# EAGLE schematic Pi2AVR (EAGLE 7.6.0)
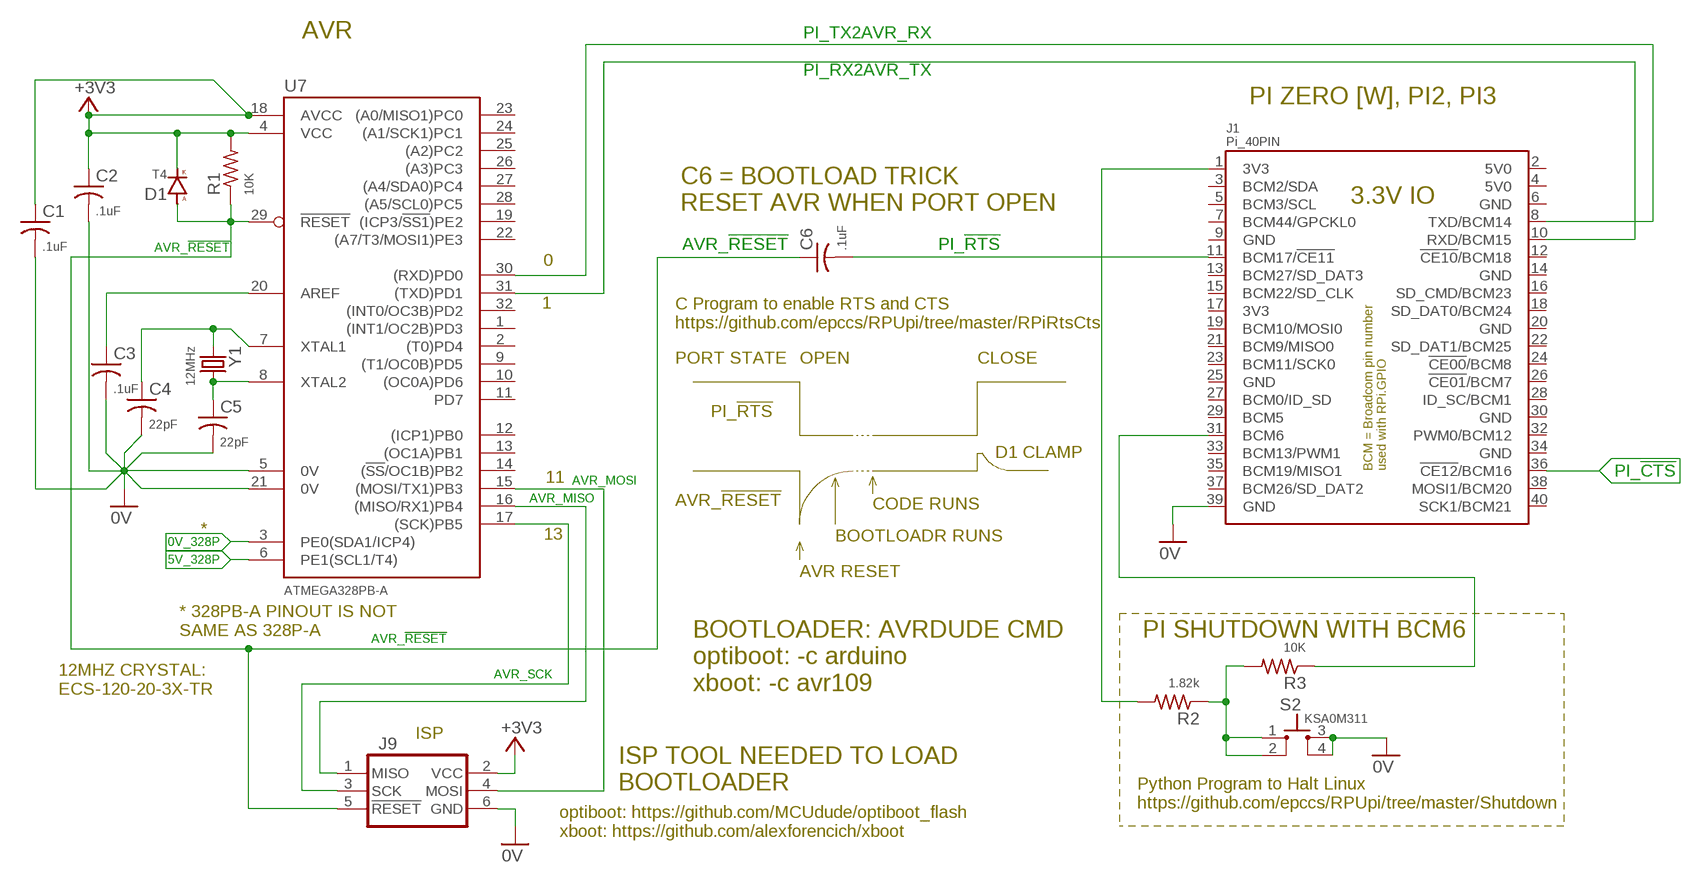
[diagram p0: schematic, sheet 1]

## Parts
C1  .1uF  CC0603A  [C0603(1608)]
C2  .1uF  CC0603A  [C0603(1608)]
C3  .1uF  CC0603A  [C0603(1608)]
C4  22pF  CC0603A  [C0603(1608)]
C5  22pF  CC0603A  [C0603(1608)]
C6  .1uF  CC0603A  [C0603(1608)]
D1  T4  DSOD123  [SOD123]
J1  Pi_40PIN  RPI-ZERO90  [RASPI_ZERO_V40PIN]
J9  ISP-SPIPTH  [ISP]
R1  10K  R0805  [C0805(2012)]
R2  1.82k  R0805  [C0805(2012)]
R3  10K  R0805  [C0805(2012)]
S2  KSA0M311  [0M311]
U7  ATMEGA328PB-A  ATMEGA328PB-AU  [TQFP32-08]
Y1  12MHz  CSM-3X  [CSM-3X]

## Nets
0V: C1.2 C2.2 C3.2 C4.2 C5.2 J1.39(GND) J9.6(GND) S2.3 S2.4 U7.5(0V) U7.21(0V)
0V_328P: U7.3(PE0(SDA1/ICP4))
3V3@1: J1.1(3V3) R2.2
5V_328P: U7.6(PE1(SCL1/T4))
+3V3: C1.1 C2.1 D1.C(K) J9.2(VCC) R1.2 U7.4(VCC) U7.18(AVCC)
AVR_!RESET: C6.1 D1.A J9.5(!RESET) R1.1 U7.29(!RESET)
AVR_MISO: J9.1(MISO) U7.16((MISO/RX1)PB4)
AVR_MOSI: J9.4(MOSI) U7.15((MOSI/TX1)PB3)
AVR_SCK: J9.3(SCK) U7.17((SCK)PB5)
MGR_AREF: C3.1 U7.20(AREF)
N$1: J1.31(BCM6) R3.1
N$7: R2.1 R3.2 S2.1 S2.2
PI_!CTS!: J1.36(!CE12!/BCM16)
PI_!RTS!: C6.2 J1.11(BCM17/!CE11!)
PI_RX2AVR_TX: J1.10(RXD/BCM15) U7.31((TXD)PD1)
PI_TX2AVR_RX: J1.8(TXD/BCM14) U7.30((RXD)PD0)
XTAL1: C4.1 U7.7(XTAL1) Y1.1
XTAL2: C5.1 U7.8(XTAL2) Y1.2
Unconnected: J1.2(5V0) J1.3(BCM2/SDA) J1.4(5V0) J1.5(BCM3/SCL) J1.6(GND) J1.7(BCM44/GPCKL0) J1.9(GND) J1.12(!CE10!/BCM18) J1.13(BCM27/SD_DAT3) J1.14(GND) J1.15(BCM22/SD_CLK) J1.16(SD_CMD/BCM23) J1.17(3V3) J1.18(SD_DAT0/BCM24) J1.19(BCM10/MOSI0) J1.20(GND) J1.21(BCM9/MISO0) J1.22(SD_DAT1/BCM25) J1.23(BCM11/SCK0) J1.24(!CE00!/BCM8) J1.25(GND) J1.26(!CE01!/BCM7) J1.27(BCM0/ID_SD) J1.28(ID_SC/BCM1) J1.29(BCM5) J1.30(GND) J1.32(PWM0/BCM12) J1.33(BCM13/PWM1) J1.34(GND) J1.35(BCM19/MISO1) J1.37(BCM26/SD_DAT2) J1.38(MOSI1/BCM20) J1.40(SCK1/BCM21) U7.1((INT1/OC2B)PD3) U7.2((T0)PD4) U7.9((T1/OC0B)PD5) U7.10((OC0A)PD6) U7.11(PD7) U7.12((ICP1)PB0) U7.13((OC1A)PB1) U7.14((!SS!/OC1B)PB2) U7.19((ICP3/!SS1!)PE2) U7.22((A7/T3/MOSI1)PE3) U7.23((A0/MISO1)PC0) U7.24((A1/SCK1)PC1) U7.25((A2)PC2) U7.26((A3)PC3) U7.27((A4/SDA0)PC4) U7.28((A5/SCL0)PC5) U7.32((INT0/OC3B)PD2)

## Notes on the sheet
- AVR
- PI ZERO [W], PI2, PI3
- C6 = BOOTLOAD TRICK
  RESET AVR WHEN PORT OPEN
- 0
- 1
- C Program to enable RTS and CTS
  https://github.com/epccs/RPUpi/tree/master/RPiRtsCts
- PORT STATE | OPEN | CLOSE
- PI_!RTS!
- D1 CLAMP
- 11
- AVR_!RESET! | CODE RUNS
- *
- 13 | BOOTLOADR RUNS
- AVR RESET
- * 328PB-A PINOUT IS NOT 
  SAME AS 328P-A
- PI SHUTDOWN WITH BCM6
- BOOTLOADER: AVRDUDE CMD
  optiboot: -c arduino
  xboot: -c avr109
- 12MHZ CRYSTAL:
  ECS-120-20-3X-TR
- ISP
- ISP TOOL NEEDED TO LOAD
  BOOTLOADER
- Python Program to Halt Linux
  https://github.com/epccs/RPUpi/tree/master/Shutdown
- optiboot: https://github.com/MCUdude/optiboot_flash
  xboot: https://github.com/alexforencich/xboot

## Library data of the parts
C1-C6 = C-C:C: CAPACITOR Symbol
D1 = D-GP:D: DIODE
J1 = U-Pi:RPI-ZERO: Raspberry Pi Zero https://pinout.xyz/ NOTE: WiFi is needed see https://www.kickstarter.com/projects/1991736672/iot-hat-for-raspberry-pi-a-must-have-for-pi-zero
J9 = U-AVR:ISP-SPI: AVR ISP thru SPI In-System Programming uses the target Atmel AVR’s internal SPI (Serial Peripheral Interface) to download code into the flash and EEPROM memories. It is not a debugging interface. When designing an application PCB which includes an AVR with the SPI interface, this pinout should be used. Sparkfun SKU: BOB-08508
R1-R3 = R-C:R: Resiistor American-style symbol
S2 = S-Tactile:KSA: KSA0M311 [C&K,KSA0M311LFT] SWITCH TACTILE SEALED SPST-NO 50MA 32V
U7 = U-AVR:ATMEGA328PB-AU: ATmega328PB 4 Kbytes FLASH 128 bytes SRAM 256 bytes EEPROM 2 UART, 2 I2C, 2 SPI 8-channel 10 bit ADC
Y1 = Y-XTL:CSM: 16MHZ20 [ECS,ECS-160-20-3X-TR] CRYSTAL 16MHZ 20PF 30PPM CSM-3X